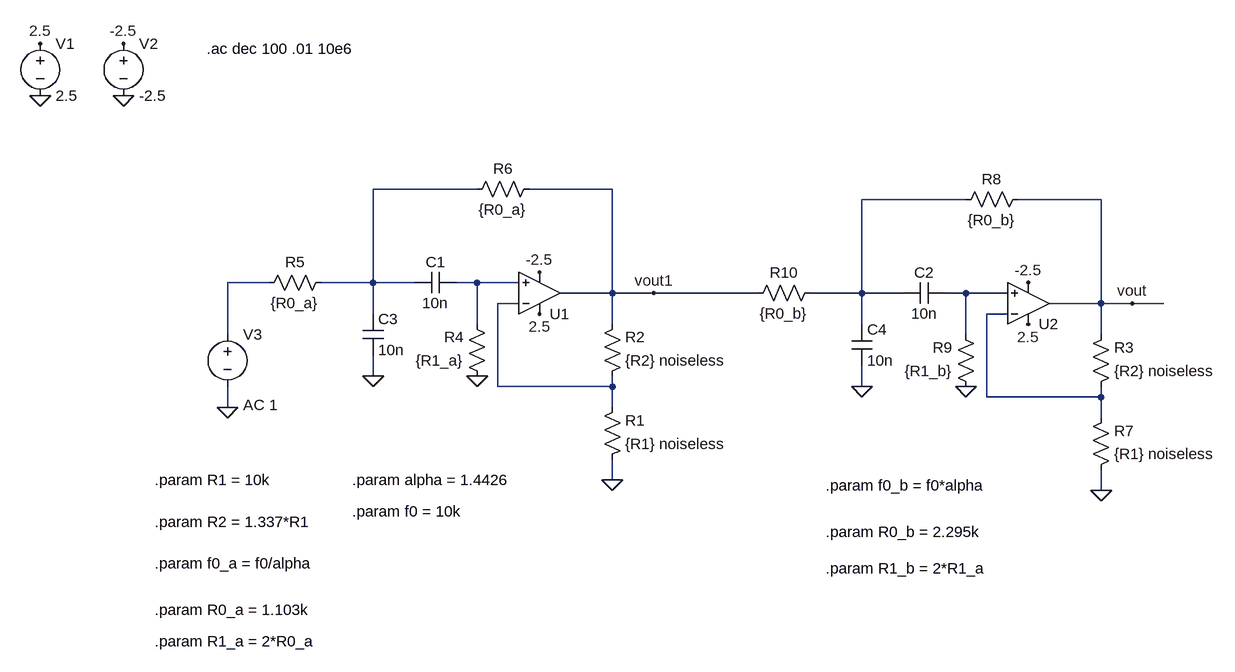
[diagram p0: schematic sallen_key_4th_order_BP_staggered.asc]
sallen_key_4th_order_BP_staggered.asc, the LTspice schematic file:
Version 4
SHEET 1 1556 680
WIRE 256 -32 96 -32
WIRE 464 -32 336 -32
WIRE 1008 -16 848 -16
WIRE 1216 -16 1088 -16
WIRE -64 112 -128 112
WIRE 96 112 96 -32
WIRE 96 112 16 112
WIRE 160 112 96 112
WIRE 256 112 224 112
WIRE 320 112 256 112
WIRE 464 128 464 -32
WIRE 464 128 384 128
WIRE 528 128 464 128
WIRE 688 128 528 128
WIRE 848 128 848 -16
WIRE 848 128 768 128
WIRE 912 128 848 128
WIRE 1008 128 976 128
WIRE 1072 128 1008 128
WIRE 320 144 288 144
WIRE 1216 144 1216 -16
WIRE 1216 144 1136 144
WIRE 1264 144 1216 144
WIRE 1312 144 1264 144
WIRE 96 160 96 112
WIRE 1072 160 1040 160
WIRE 256 176 256 112
WIRE 464 176 464 128
WIRE 848 176 848 128
WIRE -128 192 -128 112
WIRE 1008 192 1008 128
WIRE 1216 192 1216 144
WIRE 96 256 96 224
WIRE 288 272 288 144
WIRE 464 272 464 256
WIRE 464 272 288 272
WIRE 848 272 848 240
WIRE 1040 288 1040 160
WIRE 1216 288 1216 272
WIRE 1216 288 1040 288
WIRE -128 304 -128 272
WIRE 464 304 464 272
WIRE 1216 320 1216 288
WIRE 464 416 464 384
WIRE 1216 432 1216 400
FLAG 352 160 2.5
FLAG 352 96 -2.5
FLAG 256 256 0
FLAG -416 -256 2.5
FLAG -288 -256 -2.5
FLAG -416 -176 0
FLAG -288 -176 0
FLAG 464 416 0
FLAG 96 256 0
FLAG -128 304 0
FLAG 1104 176 2.5
FLAG 1104 112 -2.5
FLAG 1008 272 0
FLAG 528 128 vout1
FLAG 1216 432 0
FLAG 848 272 0
FLAG 1264 144 vout
SYMBOL Opamps\\UniversalOpamp2 352 128 M180
SYMATTR InstName U1
SYMATTR Value2 Avol=10Meg GBW=10Meg Slew=10Meg
SYMBOL cap 224 96 R90
WINDOW 0 0 32 VBottom 2
WINDOW 3 32 32 VTop 2
SYMATTR InstName C1
SYMATTR Value 10n
SYMBOL voltage -416 -272 R0
WINDOW 123 0 0 Left 0
WINDOW 39 0 0 Left 0
SYMATTR InstName V1
SYMATTR Value 2.5
SYMBOL voltage -288 -272 R0
WINDOW 123 0 0 Left 0
WINDOW 39 0 0 Left 0
SYMATTR InstName V2
SYMATTR Value -2.5
SYMBOL res 448 272 M180
WINDOW 0 36 76 Left 2
WINDOW 3 36 40 Left 2
SYMATTR InstName R2
SYMATTR Value {R2} noiseless
SYMBOL res 448 400 M180
WINDOW 0 36 76 Left 2
WINDOW 3 36 40 Left 2
SYMATTR InstName R1
SYMATTR Value {R1} noiseless
SYMBOL res 352 -48 R90
WINDOW 0 0 56 VBottom 2
WINDOW 3 32 56 VTop 2
SYMATTR InstName R6
SYMATTR Value {R0_a}
SYMBOL res 272 272 R180
WINDOW 0 36 76 Left 2
WINDOW 3 36 40 Left 2
SYMATTR InstName R4
SYMATTR Value {R1_a}
SYMBOL cap 80 160 R0
SYMATTR InstName C3
SYMATTR Value 10n
SYMBOL res -80 128 R270
WINDOW 0 32 56 VTop 2
WINDOW 3 0 56 VBottom 2
SYMATTR InstName R5
SYMATTR Value {R0_a}
SYMBOL voltage -128 176 R0
WINDOW 123 24 124 Left 2
WINDOW 39 0 0 Left 0
SYMATTR InstName V3
SYMATTR Value ""
SYMATTR Value2 AC 1
SYMBOL Opamps\\UniversalOpamp2 1104 144 M180
SYMATTR InstName U2
SYMATTR Value2 Avol=10Meg GBW=10Meg Slew=10Meg
SYMBOL cap 976 112 R90
WINDOW 0 0 32 VBottom 2
WINDOW 3 32 32 VTop 2
SYMATTR InstName C2
SYMATTR Value 10n
SYMBOL res 1200 288 M180
WINDOW 0 36 76 Left 2
WINDOW 3 36 40 Left 2
SYMATTR InstName R3
SYMATTR Value {R2} noiseless
SYMBOL res 1200 416 M180
WINDOW 0 36 76 Left 2
WINDOW 3 36 40 Left 2
SYMATTR InstName R7
SYMATTR Value {R1} noiseless
SYMBOL res 1104 -32 R90
WINDOW 0 0 56 VBottom 2
WINDOW 3 32 56 VTop 2
SYMATTR InstName R8
SYMATTR Value {R0_b}
SYMBOL res 1024 288 R180
WINDOW 0 36 76 Left 2
WINDOW 3 36 40 Left 2
SYMATTR InstName R9
SYMATTR Value {R1_b}
SYMBOL cap 832 176 R0
SYMATTR InstName C4
SYMATTR Value 10n
SYMBOL res 672 144 R270
WINDOW 0 32 56 VTop 2
WINDOW 3 0 56 VBottom 2
SYMATTR InstName R10
SYMATTR Value {R0_b}
TEXT -160 -248 Left 2 !.ac dec 100 .01 10e6
TEXT -240 416 Left 2 !.param R1 = 10k
TEXT -240 480 Left 2 !.param R2 = 1.337*R1
TEXT -240 544 Left 2 !.param f0_a = f0/alpha
TEXT 64 416 Left 2 !.param alpha = 1.4426
TEXT 792 424 Left 2 !.param f0_b = f0*alpha
TEXT -240 616 Left 2 !.param R0_a = 1.103k
TEXT 792 496 Left 2 !.param R0_b = 2.295k
TEXT 64 464 Left 2 !.param f0 = 10k
TEXT -240 664 Left 2 !.param R1_a = 2*R0_a
TEXT 792 552 Left 2 !.param R1_b = 2*R1_a

The netlist it stands for:
* sallen_key_4th_order_BP_staggered.asc
XU1 N004 N006 2.5 -2.5 vout1 level.2 Avol=10Meg GBW=10Meg Slew=10Meg ilimit=25m rail=0 Vos=0 phimargin=45 en=0 enk=0 in=0 ink=0 Rin=500Meg  ; pins IN+ IN- V+ V- OUT
C1 N004 N001 10n
V1 2.5 0 2.5
V2 -2.5 0 -2.5
R2 N006 vout1 {R2} noiseless
R1 0 N006 {R1} noiseless
R6 vout1 N001 {R0_a}
R4 0 N004 {R1_a}
C3 N001 0 10n
R5 N003 N001 {R0_a}
V3 N003 0 AC 1
XU2 N005 N007 2.5 -2.5 vout level.2 Avol=10Meg GBW=10Meg Slew=10Meg ilimit=25m rail=0 Vos=0 phimargin=45 en=0 enk=0 in=0 ink=0 Rin=500Meg  ; pins IN+ IN- V+ V- OUT
C2 N005 N002 10n
R3 N007 vout {R2} noiseless
R7 0 N007 {R1} noiseless
R8 vout N002 {R0_b}
R9 0 N005 {R1_b}
C4 N002 0 10n
R10 vout1 N002 {R0_b}
.ac dec 100 .01 10e6
.param R1 = 10k
.param R2 = 1.337*R1
.param f0_a = f0/alpha
.param alpha = 1.4426
.param f0_b = f0*alpha
.param R0_a = 1.103k
.param R0_b = 2.295k
.param f0 = 10k
.param R1_a = 2*R0_a
.param R1_b = 2*R1_a
.lib UniversalOpamps2.sub
.backanno
.end